# EAGLE design Wetterstation (EAGLE 8.3.2)
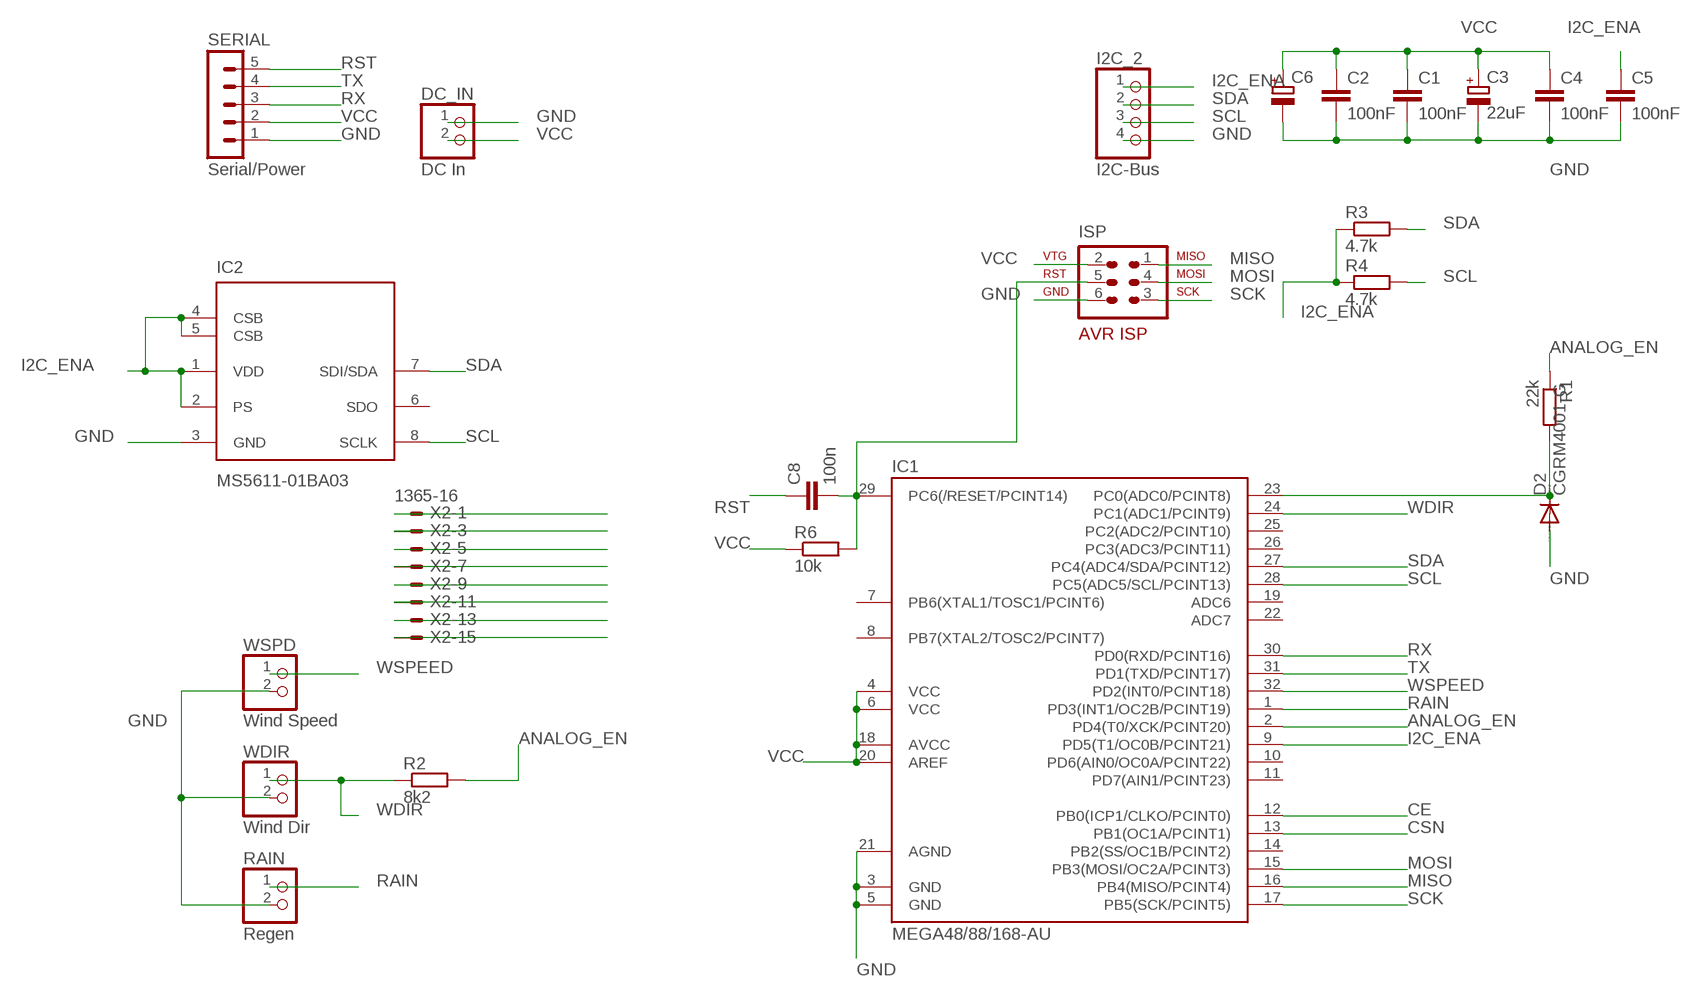
[diagram p0: schematic, sheet 1]

## Parts
C1  100nF  C-EUC0805  [C0805]
C2  100nF  C-EUC0805  [C0805]
C3  22uF  CPOL-EUSMCC  [SMC_C]
C4  100nF  C-EUC0805  [C0805]
C5  100nF  C-EUC0805  [C0805]
C6  CPOL-EUB/3528-21R  [B/3528-21R]
C8  100n  C-EUC0805  [C0805]
D2  CGRM4001-G  [SOD-123_MINI-SMA]
DC_IN  DC In  PINHD-1X2  [1X02]
I2C_2  I2C-Bus  PINHD-1X4  [1X04]
IC1  MEGA48/88/168-AU  [TQFP32-08]
IC2  MS5611-01BA03  [SON125P300X500X100-8N]
ISP  AVR-ISP-6  [AVR-ISP-6]
R1  22k  R-EU_R1206  [R1206]
R2  8k2  R-EU_R1206  [R1206]
R3  4.7k  R-EU_R1206  [R1206]
R4  4.7k  R-EU_R1206  [R1206]
R6  10k  R-EU_R1206  [R1206]
RAIN  Regen  PINHD-1X2  [1X02]
SERIAL  Serial/Power  MA05-1  [MA05-1]
WDIR  Wind Dir  PINHD-1X2  [1X02]
WSPD  Wind Speed  PINHD-1X2  [1X02]
X2  1365-16  [1365-16]

## Nets
ANALOG_EN: IC1.2(PD4(T0/XCK/PCINT20)) R1.1 R2.2
CE: IC1.12(PB0(ICP1/CLKO/PCINT0)) X2.3
CSN: IC1.13(PB1(OC1A/PCINT1)) X2.5
GND: C1.2 C2.2 C3.- C4.2 C5.2 C6.- D2.A DC_IN.1 I2C_2.4 IC1.3(GND) IC1.5(GND) IC1.21(AGND) IC2.3(GND) ISP.6 RAIN.2 SERIAL.1 WDIR.2 WSPD.2 X2.15
I2C_ENA: C5.1 I2C_2.1 IC1.9(PD5(T1/OC0B/PCINT21)) IC2.1(VDD) IC2.2(PS) IC2.4(CSB) IC2.5(CSB) R3.1 R4.1
IRQ: X2.13
MISO: IC1.16(PB4(MISO/PCINT4)) ISP.1 X2.11
MOSI: IC1.15(PB3(MOSI/OC2A/PCINT3)) ISP.4 X2.9
N$1: C8.2 IC1.29(PC6(/RESET/PCINT14)) ISP.5 R6.2
RAIN: IC1.1(PD3(INT1/OC2B/PCINT19)) RAIN.1
RST: C8.1 SERIAL.5
RX: IC1.30(PD0(RXD/PCINT16)) SERIAL.3
SCK: IC1.17(PB5(SCK/PCINT5)) ISP.3 X2.7
SCL: I2C_2.3 IC1.28(PC5(ADC5/SCL/PCINT13)) IC2.8(SCLK) R4.2
SDA: I2C_2.2 IC1.27(PC4(ADC4/SDA/PCINT12)) IC2.7(SDI/SDA) R3.2
TX: IC1.31(PD1(TXD/PCINT17)) SERIAL.4
VCC: C1.1 C2.1 C3.+ C4.1 C6.+ DC_IN.2 IC1.4(VCC) IC1.6(VCC) IC1.18(AVCC) IC1.20(AREF) ISP.2 R6.1 SERIAL.2 X2.1
VCC_MEAS: D2.C IC1.23(PC0(ADC0/PCINT8)) R1.2
WDIR: IC1.24(PC1(ADC1/PCINT9)) R2.1 WDIR.1
WSPEED: IC1.32(PD2(INT0/PCINT18)) WSPD.1
Unconnected: IC1.7(PB6(XTAL1/TOSC1/PCINT6)) IC1.8(PB7(XTAL2/TOSC2/PCINT7)) IC1.10(PD6(AIN0/OC0A/PCINT22)) IC1.11(PD7(AIN1/PCINT23)) IC1.14(PB2(SS/OC1B/PCINT2)) IC1.19(ADC6) IC1.22(ADC7) IC1.25(PC2(ADC2/PCINT10)) IC1.26(PC3(ADC3/PCINT11)) IC2.6(SDO) X2.2 X2.4 X2.6 X2.8 X2.10 X2.12 X2.14 X2.16

## Library data of the parts
C1 C2 C4 C5 C8 = rcl:C-EU: CAPACITOR, European symbol
C3 = resistor:CPOL-EU: POLARIZED CAPACITOR, European symbol
C6 = rcl:CPOL-EU: POLARIZED CAPACITOR, European symbol
D2 = diode:CGRM400*-G: Molded plasitc,JEDEC SOD-123/Mini SMA Source: Comchip CGRM4001-G.pdf
DC_IN RAIN WDIR WSPD = pinhead:PINHD-1X2: PIN HEADER
I2C_2 = pinhead:PINHD-1X4: PIN HEADER
IC1 = avr-6:MEGA48/88/168
IC2 = Measurement-Specialties:MS5611-01BA03: Variometer Module, with stainless steel cap
ISP = avr-6:AVR-ISP-6: AVR ISP-6 Serial Programming Header
R1-R4 R6 = resistor:R-EU_: RESISTOR, European symbol
SERIAL = con-lstb:MA05-1: PIN HEADER; OC_FARNELL: unknown; OC_NEWARK: unknown
X2 = con-leotronics:1365-16: DUAL ROW STRAIGHT HEADER 1364 SERIES. 1.27mm x 1.27mm. Without Fixing Post. SMT Source: http://www.leotronics.co.uk/Conexcon/Data%20Sheets/sec.%20A/1364ing.pdf; OC_FARNELL: unknown; OC_NEWARK: unknown

## Board
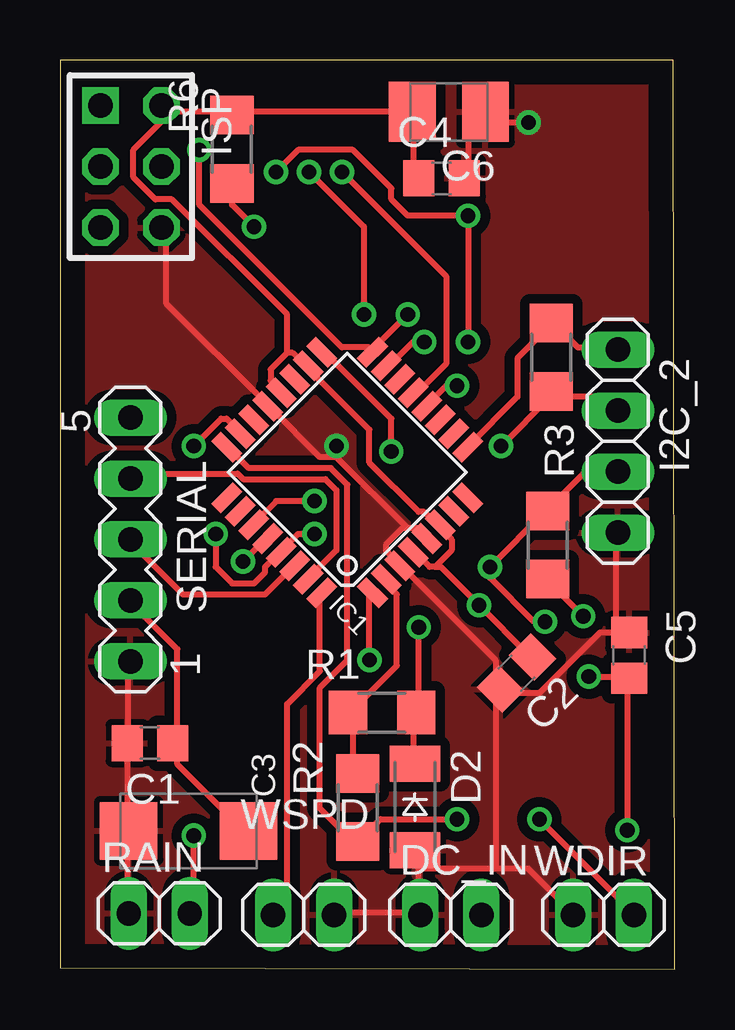
[diagram p1: board, top side]
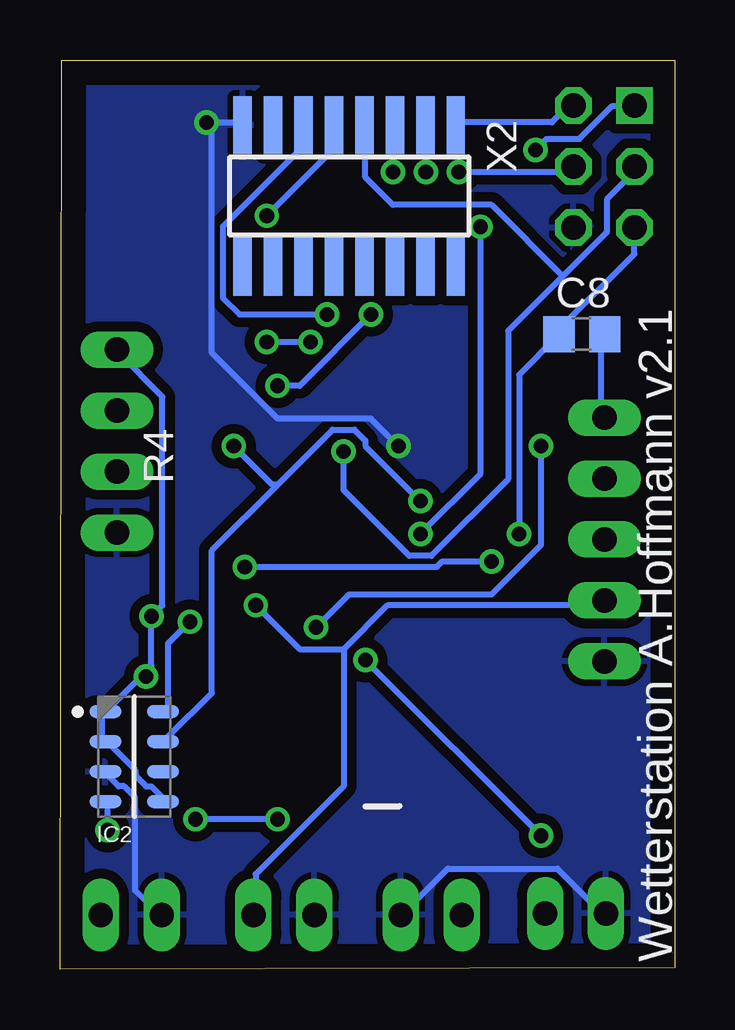
[diagram p2: board, bottom side, seen from below]

Size 25.62 x 37.89 mm. Coordinates in mm from the lower left corner, seen from the top.
Outline: 0,0.07 25.62,0 25.55,37.88 0,37.89 0,0.07
Copper layers (1*16): Top 0.035mm / dielectric 1.5mm / Bottom 0.035mm
Design rules "default": minimum track width 10mil, minimum drill 24mil, track to track 8mil, track to pad 8mil, pad to pad 8mil, via to via 8mil, smd to smd 8mil, copper to edge 40mil, drill to drill 8mil, minimum pad ring 10mil, minimum via ring 8mil, stop-mask expansion 4mil, vias tented up to drill 0mil, thermal gap 10mil

### Footprints (pad centres in the part's own frame; a part is rotated, then mirrored left to right if it is on the bottom)
C0805 = smd 1.3 x 1.5: 1 -0.95,0; 2 0.95,0
SMC_C = smd 2.4 x 2.4: + -2.5,0; - 2.5,0
B/3528-21R = smd 1.95 x 2.5: + 1.525,0; - -1.525,0
SOD-123_MINI-SMA = smd 1.5 x 2.1: A 1.8,0; C -1.8,0
1X02 = drill 1.016 long: 1 -1.27,0; 2 1.27,0
1X04 = drill 1.016 long: 1 -3.81,0; 2 -1.27,0; 3 1.27,0; 4 3.81,0
TQFP32-08 = smd 1.27 x 0.559: 1 -4.293,2.8; 2 -4.293,2; 3 -4.293,1.2; 4 -4.293,0.4; 5 -4.293,-0.4; 6 -4.293,-1.2; 7 -4.293,-2; 8 -4.293,-2.8; 17 4.293,-2.8; 18 4.293,-2; 19 4.293,-1.2; 20 4.293,-0.4; 21 4.293,0.4; 22 4.293,1.2; 23 4.293,2; 24 4.293,2.8 | smd 0.559 x 1.27: 9 -2.8,-4.293; 10 -2,-4.293; 11 -1.2,-4.293; 12 -0.4,-4.293; 13 0.4,-4.293; 14 1.2,-4.293; 15 2,-4.293; 16 2.8,-4.293; 25 2.8,4.293; 26 2,4.293; 27 1.2,4.293; 28 0.4,4.293; 29 -0.4,4.293; 30 -1.2,4.293; 31 -2,4.293; 32 -2.8,4.293
SON125P300X500X100-8N = smd 1.35 x 0.55: 1 -1.2,1.875; 2 -1.2,0.625; 3 -1.2,-0.625; 4 -1.2,-1.875; 5 1.2,-1.875; 6 1.2,-0.625; 7 1.2,0.625; 8 1.2,1.875
AVR-ISP-6 = drill 1.016 square: 1 -2.54,-1.27 | drill 1.016 octagon: 2 -2.54,1.27; 3 0,-1.27; 4 0,1.27; 5 2.54,-1.27; 6 2.54,1.27
R1206 = smd 1.6 x 1.803: 1 -1.422,0; 2 1.422,0
MA05-1 = drill 1.016 long: 1 -5.08,0; 2 -2.54,0; 3 0,0; 4 2.54,0; 5 5.08,0
1365-16 = smd 0.76 x 2.4: 1 -4.445,-2.95; 2 -4.445,2.95; 3 -3.175,-2.95; 4 -3.175,2.95; 5 -1.905,-2.95; 6 -1.905,2.95; 7 -0.635,-2.95; 8 -0.635,2.95; 9 0.635,-2.95; 10 0.635,2.95; 11 1.905,-2.95; 12 1.905,2.95; 13 3.175,-2.95; 14 3.175,2.95; 15 4.445,-2.95; 16 4.445,2.95

### Placement (x,y rotation side)
C1  3.75,9.43 180 top
C2  19.02,12.35 225 top
C3  5.36,5.77 180 top
C4  15.89,32.96 0 top
C5  23.71,13.09 90 top
C6  16.2,35.73 180 top
C8  3.87,26.47 180 bottom
D2  14.79,6.77 270 top
DC_IN  16.29,2.27 0 top
I2C_2  23.25,22.01 270 top
IC1  11.97,20.71 135 top
IC2  22.52,8.87 0 bottom
ISP  2.95,33.45 270 top
R1  13.42,10.7 0 top
R2  12.4,6.74 90 top
R3  20.47,25.51 270 top
R4  20.33,17.68 90 top
R6  7.16,34.17 270 top
RAIN  4.14,2.34 180 top
SERIAL  2.93,17.91 90 top
WDIR  22.65,2.27 180 top
WSPD  10.15,2.27 0 top
X2  13.57,32.23 180 bottom

### Tracks (layer width: path | path; a pad name or v marks a point on that pad's centre or on a via)
ANALOG_EN
  Top 0.254: IC1.2 13.8,16.09 13.8,15.86 14.03,15.63 14.03,12.66 12.2,10.83 R1.1 12.2,10.6 12.2,8.31 R2.2
CE  (via drill 0.61)
  Top 0.254: v16.55,24.32 16.09,24.32 15.4,23.63 IC1.12 | v12.66,27.29 12.66,30.95 v10.37,33.23
  Bottom 0.254: v16.55,24.32 15.63,24.32 v12.66,27.29 | v10.37,33.23 10.37,35.06 X2.3
CSN  (via drill 0.61)
  Top 0.254: v11.75,33.23 16.09,28.89 16.09,25.23 14.95,24.09 IC1.13
  Bottom 0.254: v11.75,33.23 11.75,35.06 X2.5
GND  (via drill 0.61)
  Top 0.254: SERIAL.1 2.83,12.66 2.83,9.46 C1.2 2.83,9.23 2.83,5.8 C3.- 2.83,5.57 2.83,2.37 RAIN.2 | 14.95,2.37 14.95,4.2 | 14.95,4.2 14.95,4.89 D2.A | 14.95,2.37 11.52,2.37 WSPD.2 | 14.95,2.37 DC_IN.1 | 18.15,4.2 19.52,4.2 21.35,2.37 WDIR.2 | 18.15,4.2 14.95,4.2 | 23.18,14.03 23.63,14.03 C5.2 23.18,14.03 | 23.18,14.03 22.49,14.03 19.98,11.52 18.38,11.52 C2.2 | 23.18,14.03 23.18,18.14 I2C_2.4 | C4.2 17,33 17,34.83 17.69,35.52 C6.- 17.92,35.52 18.15,35.29 v19.52,35.29 | 14.49,18.37 14.95,18.37 15.17,18.14 IC1.5 | 14.49,18.37 14.26,18.37 13.57,17.69 13.57,17.46 14.03,17 IC1.3 14.26,16.77 18.15,12.89 18.15,11.74 C2.2 | 11.52,21.35 10.83,21.35 8.77,23.4 IC1.21 8.55,23.63 4.43,27.75 4.43,30.72 ISP.6 | 14.49,18.37 11.52,21.35 | 11.52,21.35 v11.52,21.8 | 18.15,4.2 18.15,11.52 C2.2
  Bottom 0.254: IC2.3 23.63,8.09 23.18,7.63 22.95,7.63 22.49,7.17 22.49,3.29 21.58,2.37 WDIR.2 | RAIN.2 3.06,2.37 4.89,4.2 9.46,4.2 11.29,2.37 WSPD.2 | 19.29,35.29 18.15,35.29 X2.15 | 19.29,35.29 19.29,25.69 16.55,22.95 12.66,22.95 v11.52,21.8 | 19.29,35.29 v19.52,35.29
  pour Top (isolate 0.406): 25.55,37.85 25.55,0.09 0.07,0.12 0.05,37.83
  pour Bottom (isolate 0.406): 25.55,37.85 25.55,0.09 0.1,0.09 0.04,37.83
I2C_ENA  (via drill 0.61)
  Top 0.254: IC1.9 17,21.8 19.06,23.86 19.06,25.46 20.43,26.83 R3.1 20.66,26.83 21.58,25.92 23.18,25.92 I2C_2.1 | v23.63,5.8 23.63,11.97 C5.1 23.63,12.2 v22.03,12.2 | v21.8,14.72 20.43,16.09 R4.1
  Bottom 0.254: v23.63,5.8 23.63,6.94 IC2.4 | IC2.5 21.35,7.17 21.8,7.63 22.03,7.63 22.49,8.09 22.49,8.31 23.63,9.46 IC2.2 23.86,9.69 23.86,10.6 IC2.1 23.63,10.83 22.03,12.43 | 22.03,12.43 21.8,12.66 v21.8,14.72 21.35,15.17 21.35,23.86 23.18,25.69 I2C_2.1 | 22.03,12.43 v22.03,12.2
MISO  (via drill 0.61)
  Top 0.254: v14.49,27.29 13.12,25.92 IC1.16 12.89,25.92 11.75,25.92 5.8,31.86 v5.8,34.15
  Bottom 0.254: v14.49,27.29 18.15,27.29 18.83,27.97 18.83,30.95 15.63,34.15 15.63,35.06 X2.11 | v5.8,34.15 5.34,34.6 3.97,34.6 2.6,35.98 ISP.1
MOSI  (via drill 0.61)
  Top 0.254: v15.17,26.15 14.72,26.15 13.8,25.23 IC1.15 | v17,26.15 v17,31.4 14.49,31.4 13.8,32.09 13.8,32.55 12.2,34.15 9.92,34.15 v9,33.23
  Bottom 0.254: v17,26.15 v15.17,26.15 | v17,31.4 14.26,34.15 14.26,35.06 X2.9 | v9,33.23 4.43,33.23 ISP.4
N$1  (via drill 0.61)
  Top 0.254: v6.49,18.14 6.49,16.77 7.17,16.09 8.09,16.09 8.55,16.54 8.55,16.77 9,17.23 IC1.29 9.23,17.46 9.92,18.14 v10.6,18.14 | v8.09,30.95 7.17,31.86 7.17,32.55 R6.2
  Bottom 0.254: v6.49,18.14 6.49,24.77 4.89,26.37 C8.2 4.89,26.6 1.69,29.8 1.69,30.72 ISP.5 | v8.09,30.95 8.09,20.66 v10.6,18.14
RAIN  (via drill 0.61)
  Top 0.254: v12.89,12.89 12.89,15.63 IC1.1 | v5.57,5.57 5.57,2.37 RAIN.1
  Bottom 0.254: v5.57,5.57 v12.89,12.89
RST
  Bottom 0.254: C8.1 3.06,26.37 3.06,23.17 SERIAL.5
RX
  Top 0.254: IC1.30 9.69,16.77 8.55,15.63 5.12,15.63 3.06,17.69 SERIAL.3
SCK  (via drill 0.61)
  Top 0.254: v13.8,21.57 13.8,22.95 11.06,25.69 IC1.17
  Bottom 0.254: v13.8,21.57 13.8,19.97 11.06,17.23 10.15,17.23 6.95,20.43 6.95,26.6 4.66,28.89 | 4.66,28.89 2.83,30.72 2.83,32.09 1.69,33.23 ISP.3 | 4.66,28.89 7.63,31.86 11.75,31.86 12.89,33 12.89,35.06 X2.7
SCL  (via drill 0.61)
  Top 0.254: v7.63,17 8.55,17.92 IC1.28 | v20.2,14.49 19.75,14.49 17.92,16.32 v17.92,16.77 20.2,19.06 R4.2 20.43,19.29 21.8,20.66 23.18,20.66 I2C_2.3
  Bottom 0.254: v7.63,17 9.69,17 9.92,16.77 v17.92,16.77 | v20.2,14.49 21.12,13.57 21.12,10.83 IC2.8
SDA  (via drill 0.61)
  Top 0.254: I2C_2.2 23.18,23.4 22.72,23.86 20.66,23.86 R3.2 20.43,23.86 v18.38,21.8 | v10.6,19.52 9,19.52 8.09,18.6 IC1.27
  Bottom 0.254: v10.6,19.52 12.89,21.8 12.89,22.03 13.35,22.49 14.26,22.49 16.55,20.2 | 16.55,20.2 19.29,17.46 19.29,11.52 21.12,9.69 IC2.7 | v18.38,21.8 16.77,20.2 16.55,20.2
TX
  Top 0.254: IC1.31 10.37,16.32 11.52,17.46 11.52,19.97 11.06,20.43 7.63,20.43 7.4,20.66 3.06,20.66 SERIAL.4
VCC  (via drill 0.61)
  Top 0.254: C3.+ 7.63,5.8 4.89,8.54 4.89,9.23 C1.1 4.89,9.46 4.89,13.34 3.06,15.17 SERIAL.2 | C4.1 14.72,33 14.72,35.52 C6.+ 14.49,35.75 7.17,35.75 R6.1 6.95,35.75 4.66,35.75 | 4.66,35.75 4.43,35.98 ISP.2 4.66,35.75 | 9.46,25.69 8.77,25 8.77,24.55 9,24.32 9,24.09 IC1.20 | 9.46,25.69 9.69,25.69 10.15,25.23 IC1.18 10.37,25 12.89,22.49 12.89,21.12 14.95,19.06 15.17,19.06 15.63,18.6 IC1.6 15.86,18.37 16.32,17.92 16.32,17.46 15.63,16.77 | 15.63,16.77 15.4,16.77 14.95,17.23 IC1.4 | 15.63,16.77 15.86,16.77 v17.46,15.17 19.52,13.12 C2.1 | 4.66,35.75 3.06,34.15 3.06,33 3.97,32.09 4.66,32.09 9.46,27.29 9.46,25.69
  Bottom 0.254: 13.8,13.34 13.8,7.63 17.46,3.97 17.46,2.37 DC_IN.2 | 13.8,13.34 11.97,15.17 3.06,15.17 SERIAL.2 | X2.1 9,35.29 5.12,35.29 4.43,35.98 ISP.2 | 13.8,13.34 15.63,13.34 v17.46,15.17
VCC_MEAS  (via drill 0.61)
  Top 0.254: v5.57,21.8 6.72,22.95 6.95,22.95 7.4,22.49 IC1.23 | v14.95,14.26 14.95,10.83 R1.2 14.72,10.6 14.72,8.77 D2.C
  Bottom 0.254: v5.57,21.8 5.57,17.69 7.63,15.63 13.57,15.63 v14.95,14.26
WDIR  (via drill 0.61)
  Top 0.254: IC1.24 7.17,21.57 7.86,20.89 11.29,20.89 11.97,20.2 11.97,12.89 10.83,11.74 10.83,6.71 12.2,5.34 R2.1 12.43,5.34 13.35,6.26 v16.55,6.26 | v19.98,6.26 23.86,2.37 WDIR.1
  Bottom 0.254: v16.55,6.26 v19.98,6.26
WSPEED
  Top 0.254: IC1.32 10.83,15.63 10.83,12.43 9.46,11.06 9.46,2.83 9,2.37 WSPD.1

### Text on the board
bNames: Wetterstation A.Hoffmann v2.1